# Altium schematic sheet QFN16-30-46-A.SchDoc
size 609 x 419 mm; Revision: A; SheetNumber: 1; SheetTotal: 1
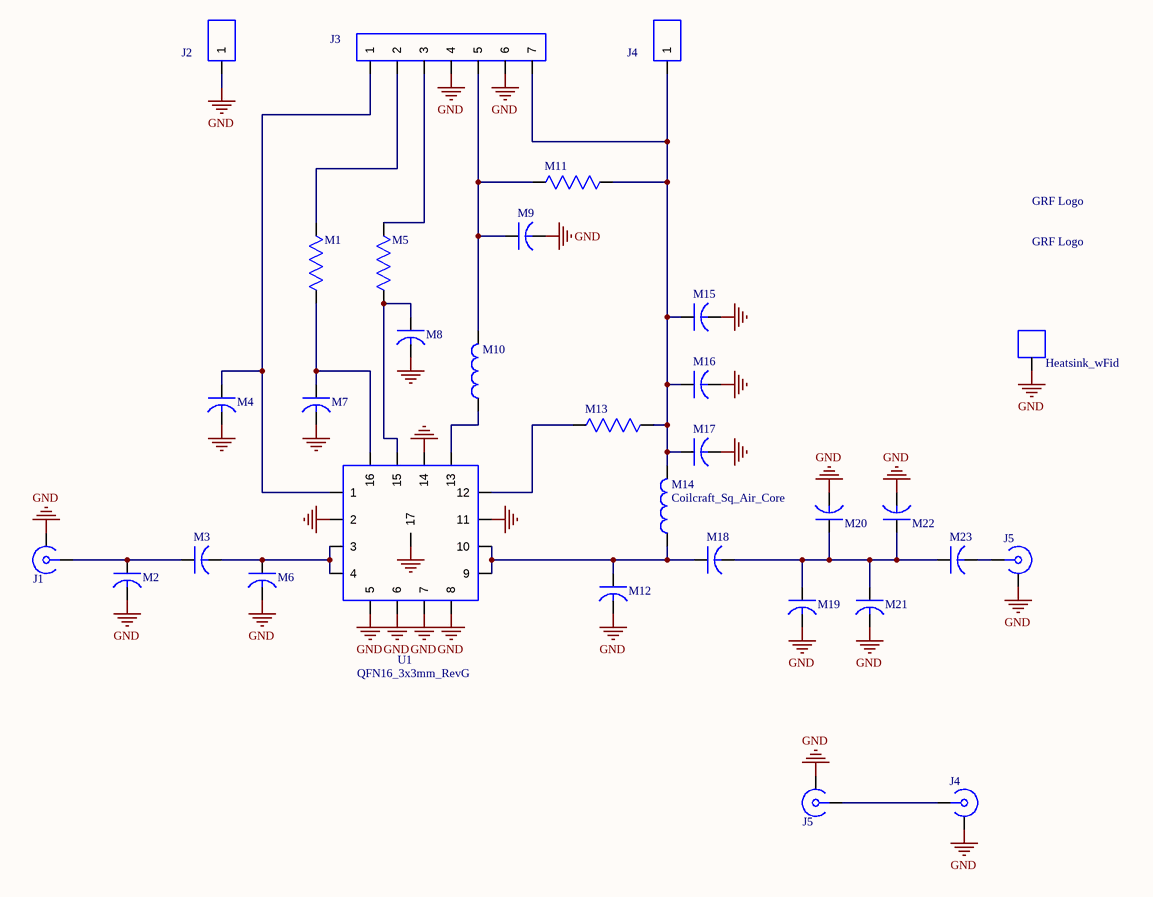
[diagram p0: QFN16-30-46-A.SchDoc]

## Parts
(Parts that share a designator on the sheet are numbered #1, #2 ... from top to bottom, then left to right.)
H1  Heatsink_wFid  [Heatsink_wFid]
J1  SMA Round_Pin_RevD + HiFreq  [SMA Round_Pin_RevD + HiFreq]  (value not drawn)
J2  Banana_Jack  [Banana_Jack]  (value not drawn)
J3  Header_7-Pin_100mil  [Header_7-Pin_100mil]  (value not drawn)
J4#1  Banana_Jack  [Banana_Jack]  (value not drawn)
J4#2  SMA Round_Pin_RevC  [SMA Round_Pin_RevD + HiFreq]  (value not drawn)
J5#1  SMA Round_Pin_RevD + HiFreq  [SMA Round_Pin_RevD + HiFreq]  (value not drawn)
J5#2  SMA Round_Pin_RevC  [SMA Round_Pin_RevD + HiFreq]  (value not drawn)
Logo1  Component_1  [GRF_2021_Full]  (value not drawn)
Logo2  Component_1  [GRF_2021_Full]  (value not drawn)
M1  0402_20x26x16  [0402_20x26x16]  (value not drawn)
M2  0402_20x26x22  [0402_20x26x22]  (value not drawn)
M3  0402_20x30x18  [0402_20x30x18]  (value not drawn)
M4  0201_10x14x11  [0201_10x14x11]  (value not drawn)
M5  0402_20x26x16  [0402_20x26x16]  (value not drawn)
M6  0402_20x26x22  [0402_20x26x22]  (value not drawn)
M7  0201_10x14x11  [0201_10x14x11]  (value not drawn)
M8  0201_10x14x11  [0201_10x14x11]  (value not drawn)
M9  0402_20x26x16  [0402_20x26x16]  (value not drawn)
M10  0402_20x26x16  [0402_20x26x16]  (value not drawn)
M11  0402_26x26x20  [0402_26x26x20]  (value not drawn)
M12  0402_20x26x22  [0402_20x26x22]  (value not drawn)
M13  0402_26x26x20  [0402_26x26x20]  (value not drawn)
M14  Coilcraft_Sq_Air_Core  [Coilcraft_Sq_Air_Core]
M15  0402_20x26x16  [0402_20x26x16]  (value not drawn)
M16  0402_20x26x16  [0402_20x26x16]  (value not drawn)
M17  0402_20x26x16  [0402_20x26x16]  (value not drawn)
M18  0402_20x30x18  [0402_20x30x18]  (value not drawn)
M19  0402_20x26x22  [0402_20x26x22]  (value not drawn)
M20  0402_20x26x22  [0402_20x26x22]  (value not drawn)
M21  0402_20x26x22  [0402_20x26x22]  (value not drawn)
M22  0402_20x26x22  [0402_20x26x22]  (value not drawn)
M23  0402_20x30x18  [0402_20x30x18]  (value not drawn)
U1  QFN16_3x3mm_RevG  [QFN16_3x3mm_RevG]

## Nets
GND: H1.1 J1.2 J2.1 J3.4 J3.6 J4#2.2 J5#1.2 J5#2.2 M2.1 M4.1 M6.1 M7.1 M8.1 M9.1 M12.1 M15.1 M16.1 M17.1 M19.1 M20.1 M21.1 M22.1 U1.2 U1.5 U1.6 U1.7 U1.8 U1.11 U1.14 U1.17
NetJ1_1: J1.1 M2.2 M3.2
NetJ3_1: J3.1 M4.2 U1.1
NetJ3_2: J3.2 M1.2
NetJ3_3: J3.3 M5.2
NetJ3_5: J3.5 M9.2 M10.2 M11.2
NetJ3_7: J3.7 J4#1.1 M11.1 M13.2 M14.2 M15.2 M16.2 M17.2
NetJ4#2_1: J4#2.1 J5#2.1
NetJ5#1_1: J5#1.1 M23.1
NetM1_1: M1.1 M7.2 U1.16
NetM3_1: M3.1 M6.2 U1.3 U1.4
NetM5_1: M5.1 M8.2 U1.15
NetM10_1: M10.1 U1.13
NetM12_2: M12.2 M14.1 M18.2 U1.9 U1.10
NetM13_1: M13.1 U1.12
NetM18_1: M18.1 M19.2 M20.2 M21.2 M22.2 M23.2

## Notes on the sheet
- REVISION
- DESCRIPTION
- DATE
- Document
- 8F
- Size
- Date
- Document Revision
- SHEET
- OF
- (in symbol Component_1) GRF Logo

## Library data of the parts
H1 = Heatsink
J1 J4#2 J5#1 J5#2 = RF_Conn
J2 J4#1 = Banana _Jack: Banana Jack, Female
J3 = Header_7-Pin: Header 7-Pin
M1 M5 M11 M13 = Resistor
M2-M4 M6-M9 M12 M15-M23 = Capacitor
M10 M14 = Inductor
U1 = QFN16_3x3mm